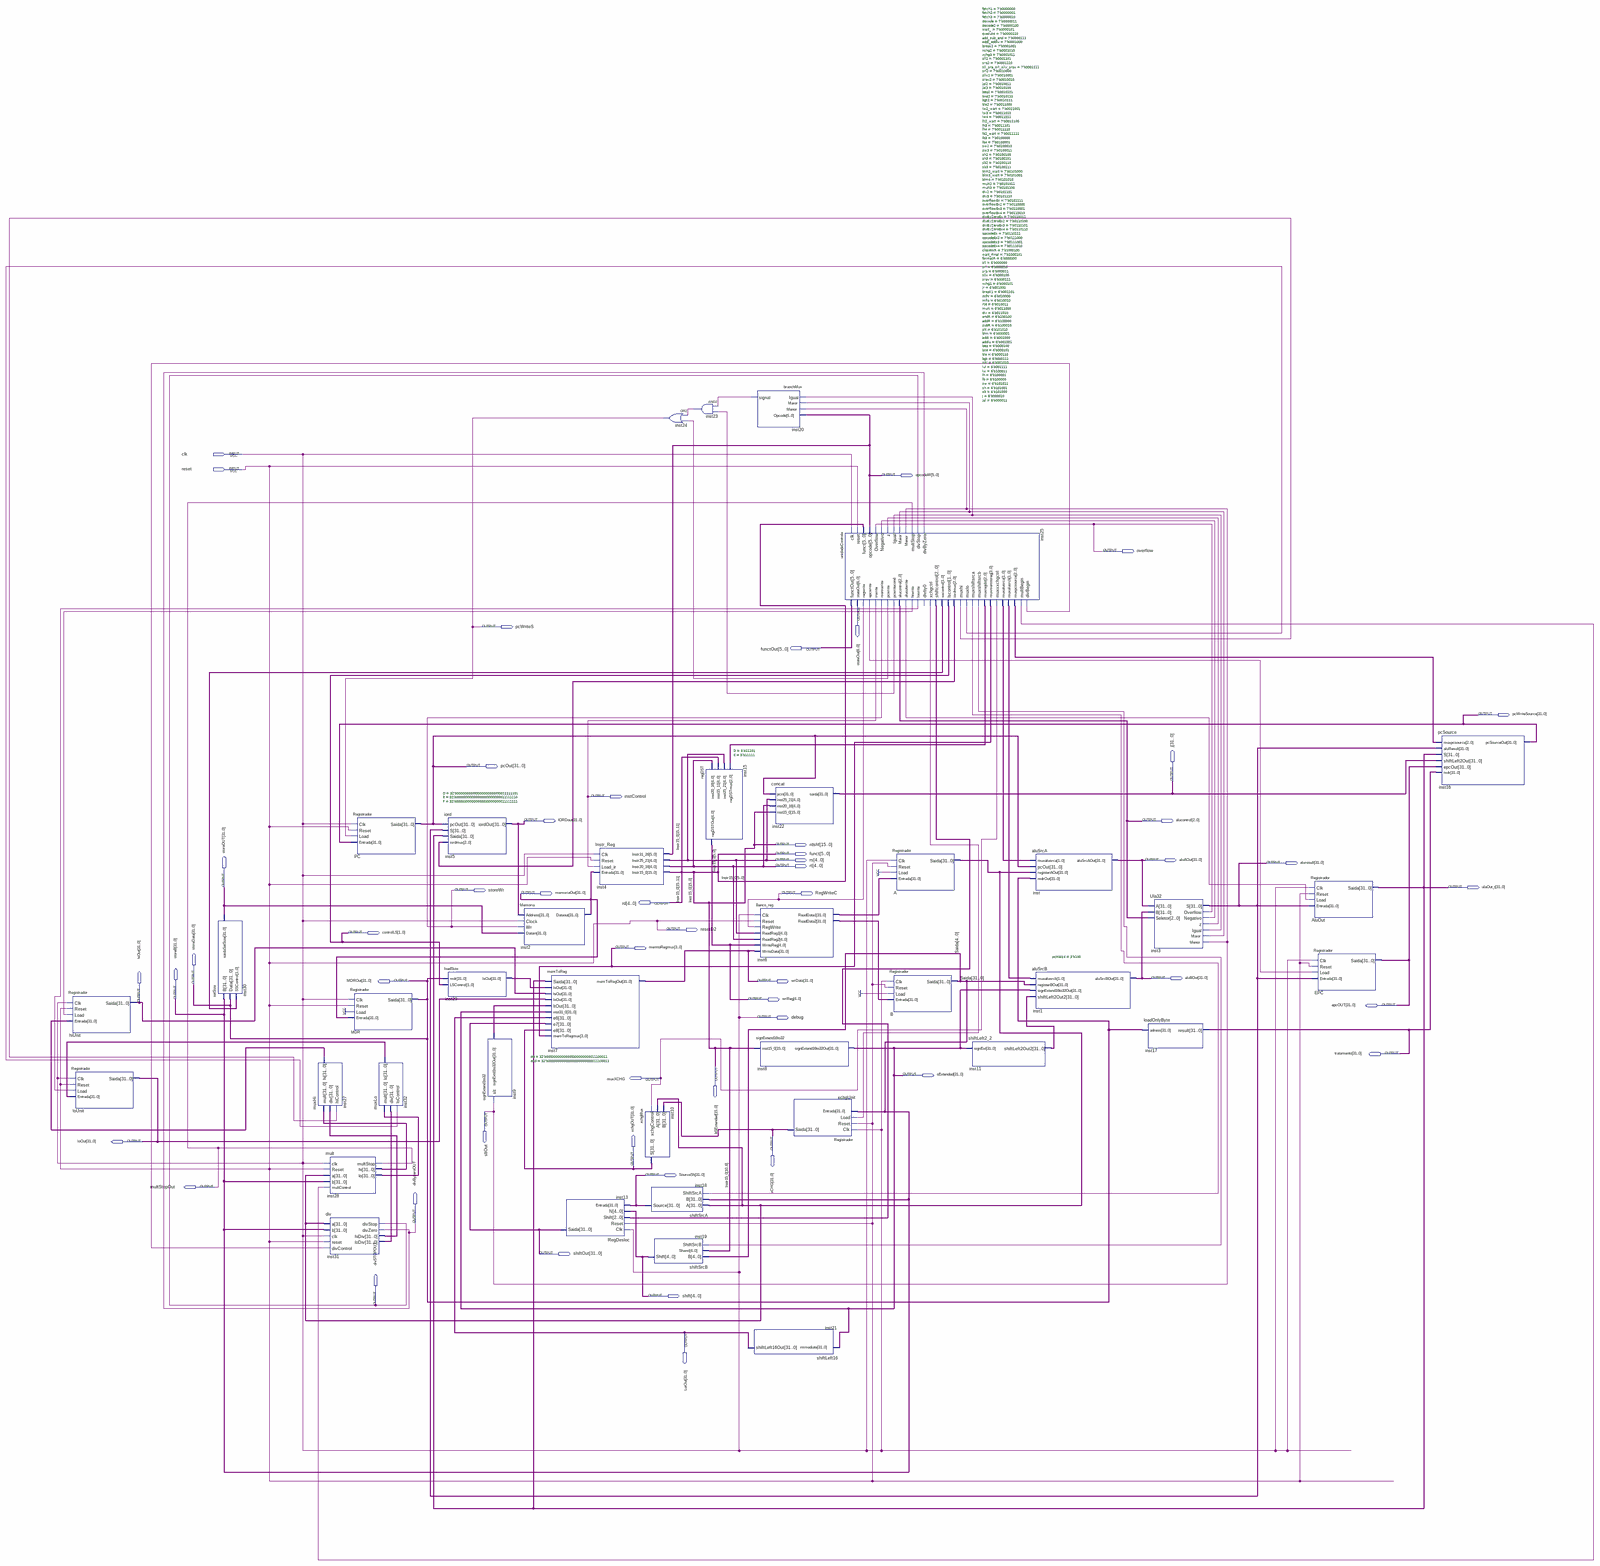
[diagram p0: schematic sheet, whole]
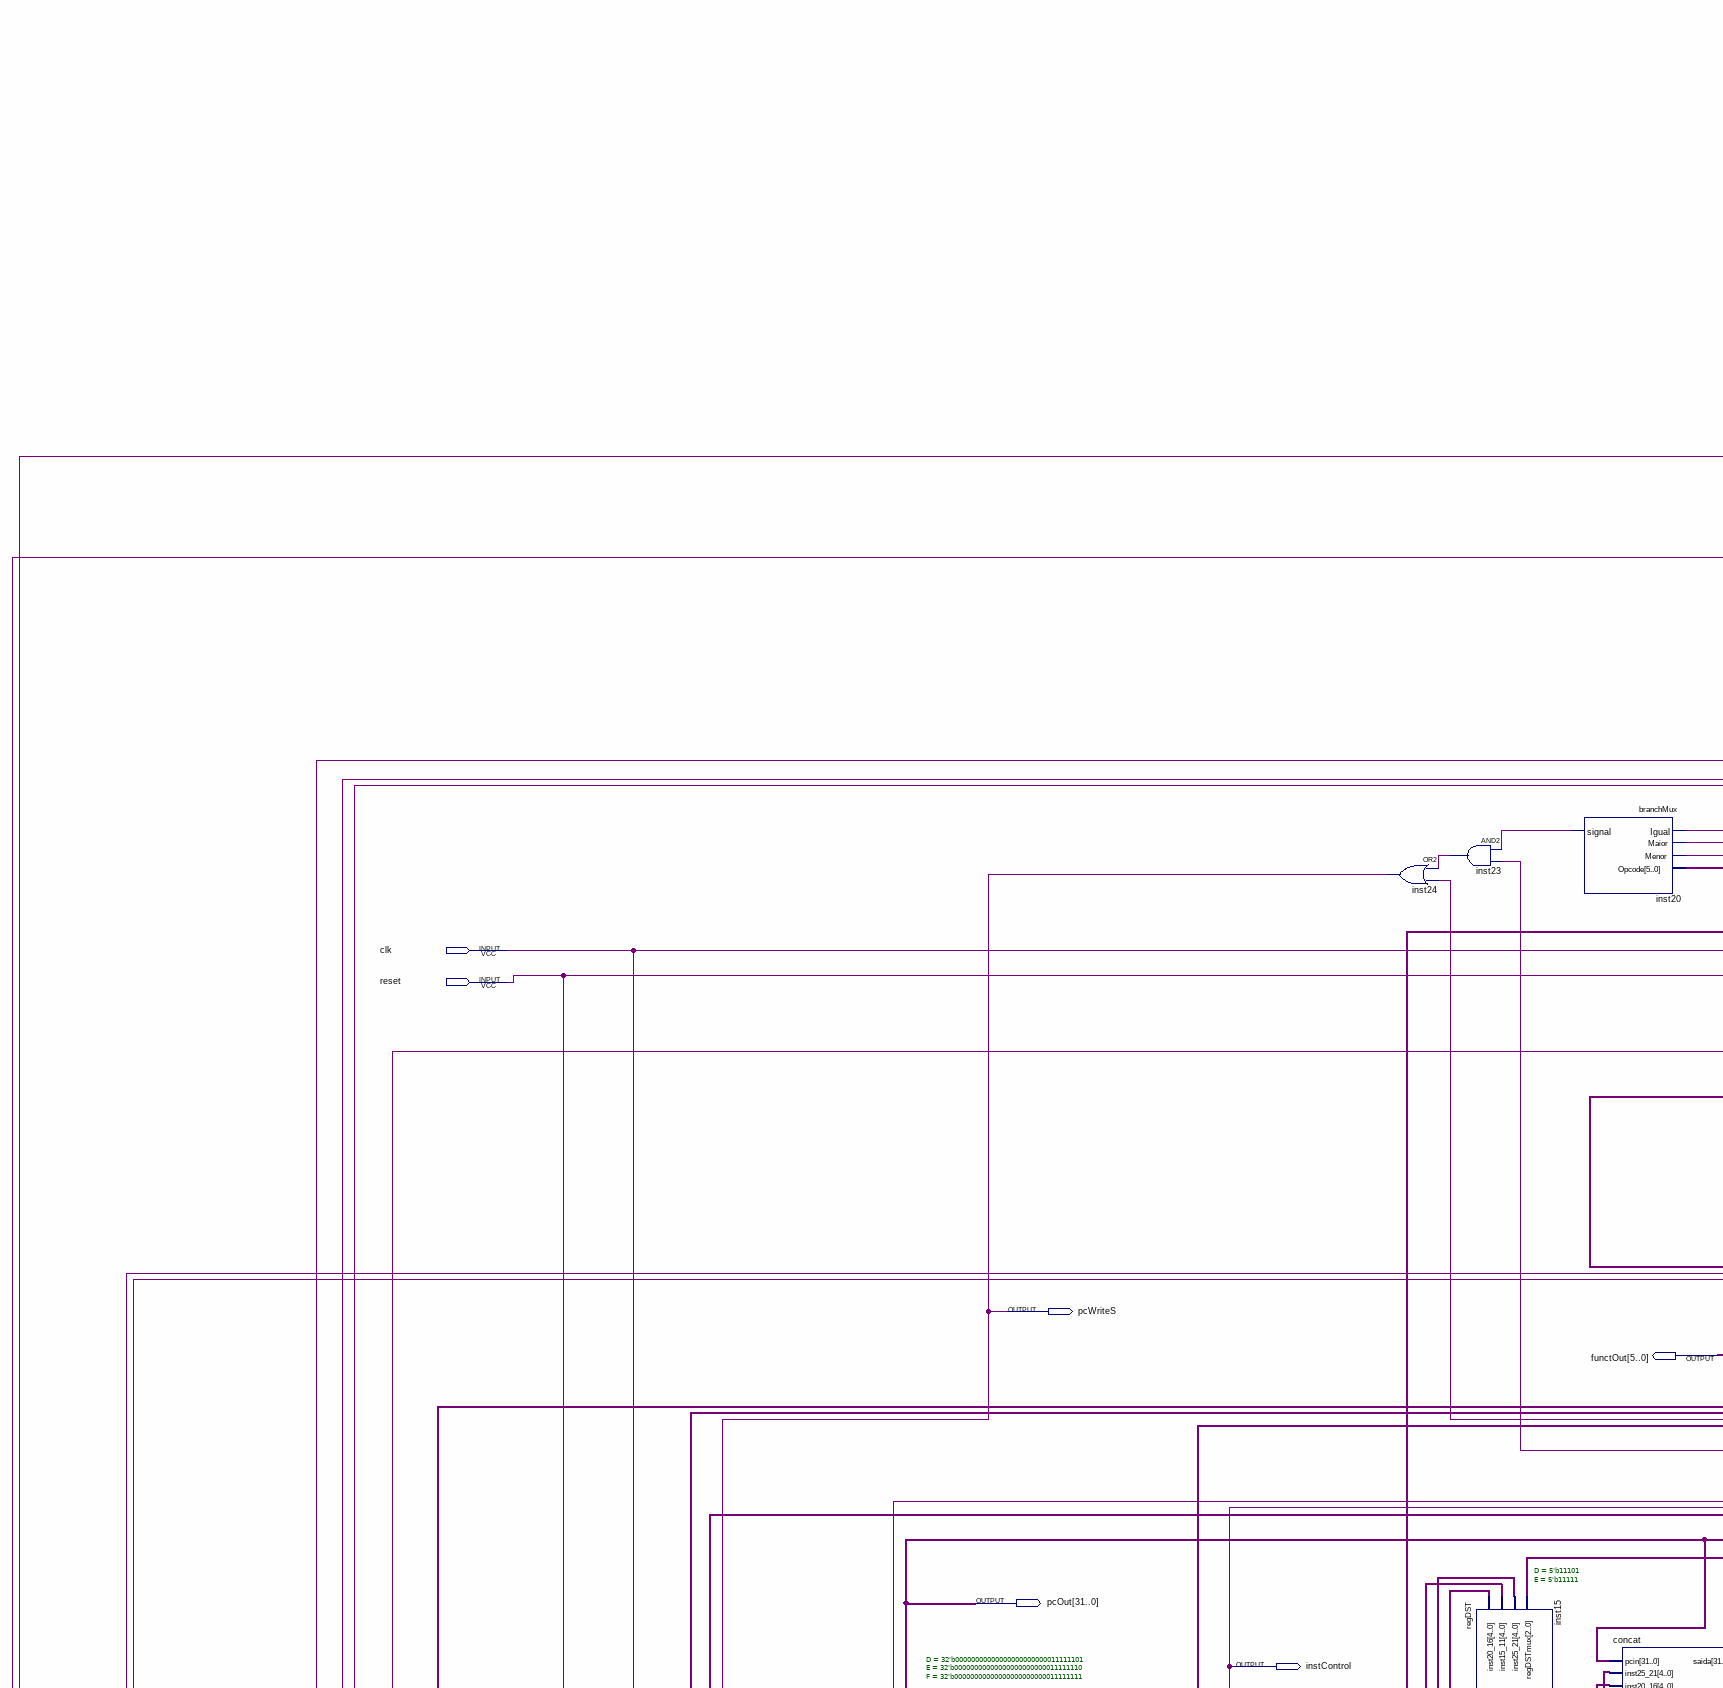
[diagram p1: schematic sheet, upper left part]
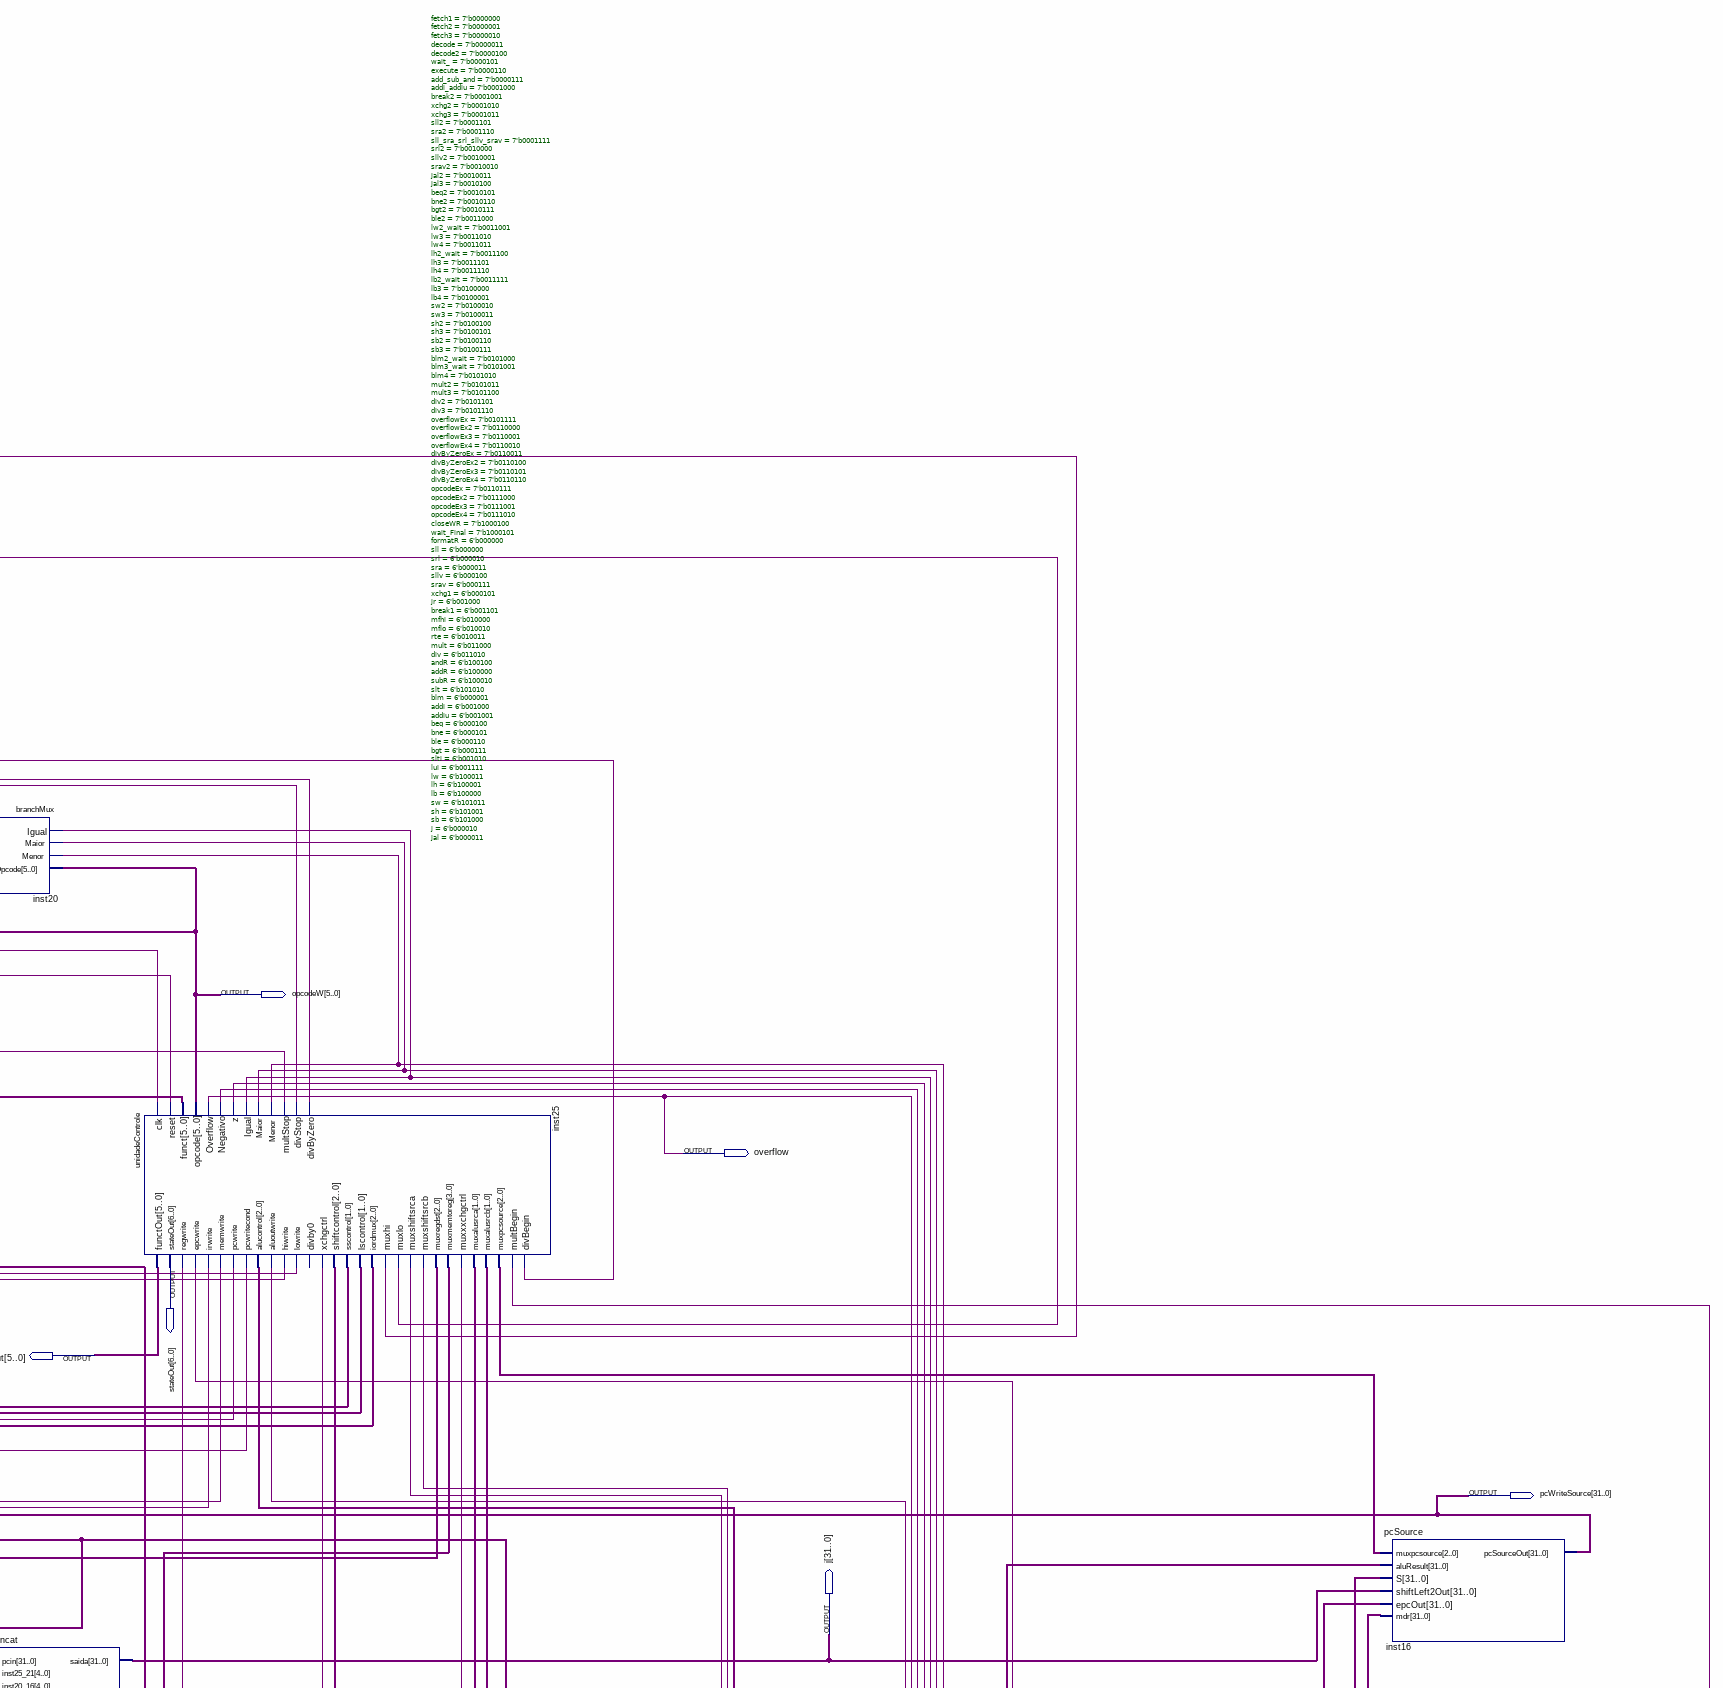
[diagram p2: schematic sheet, upper right part]
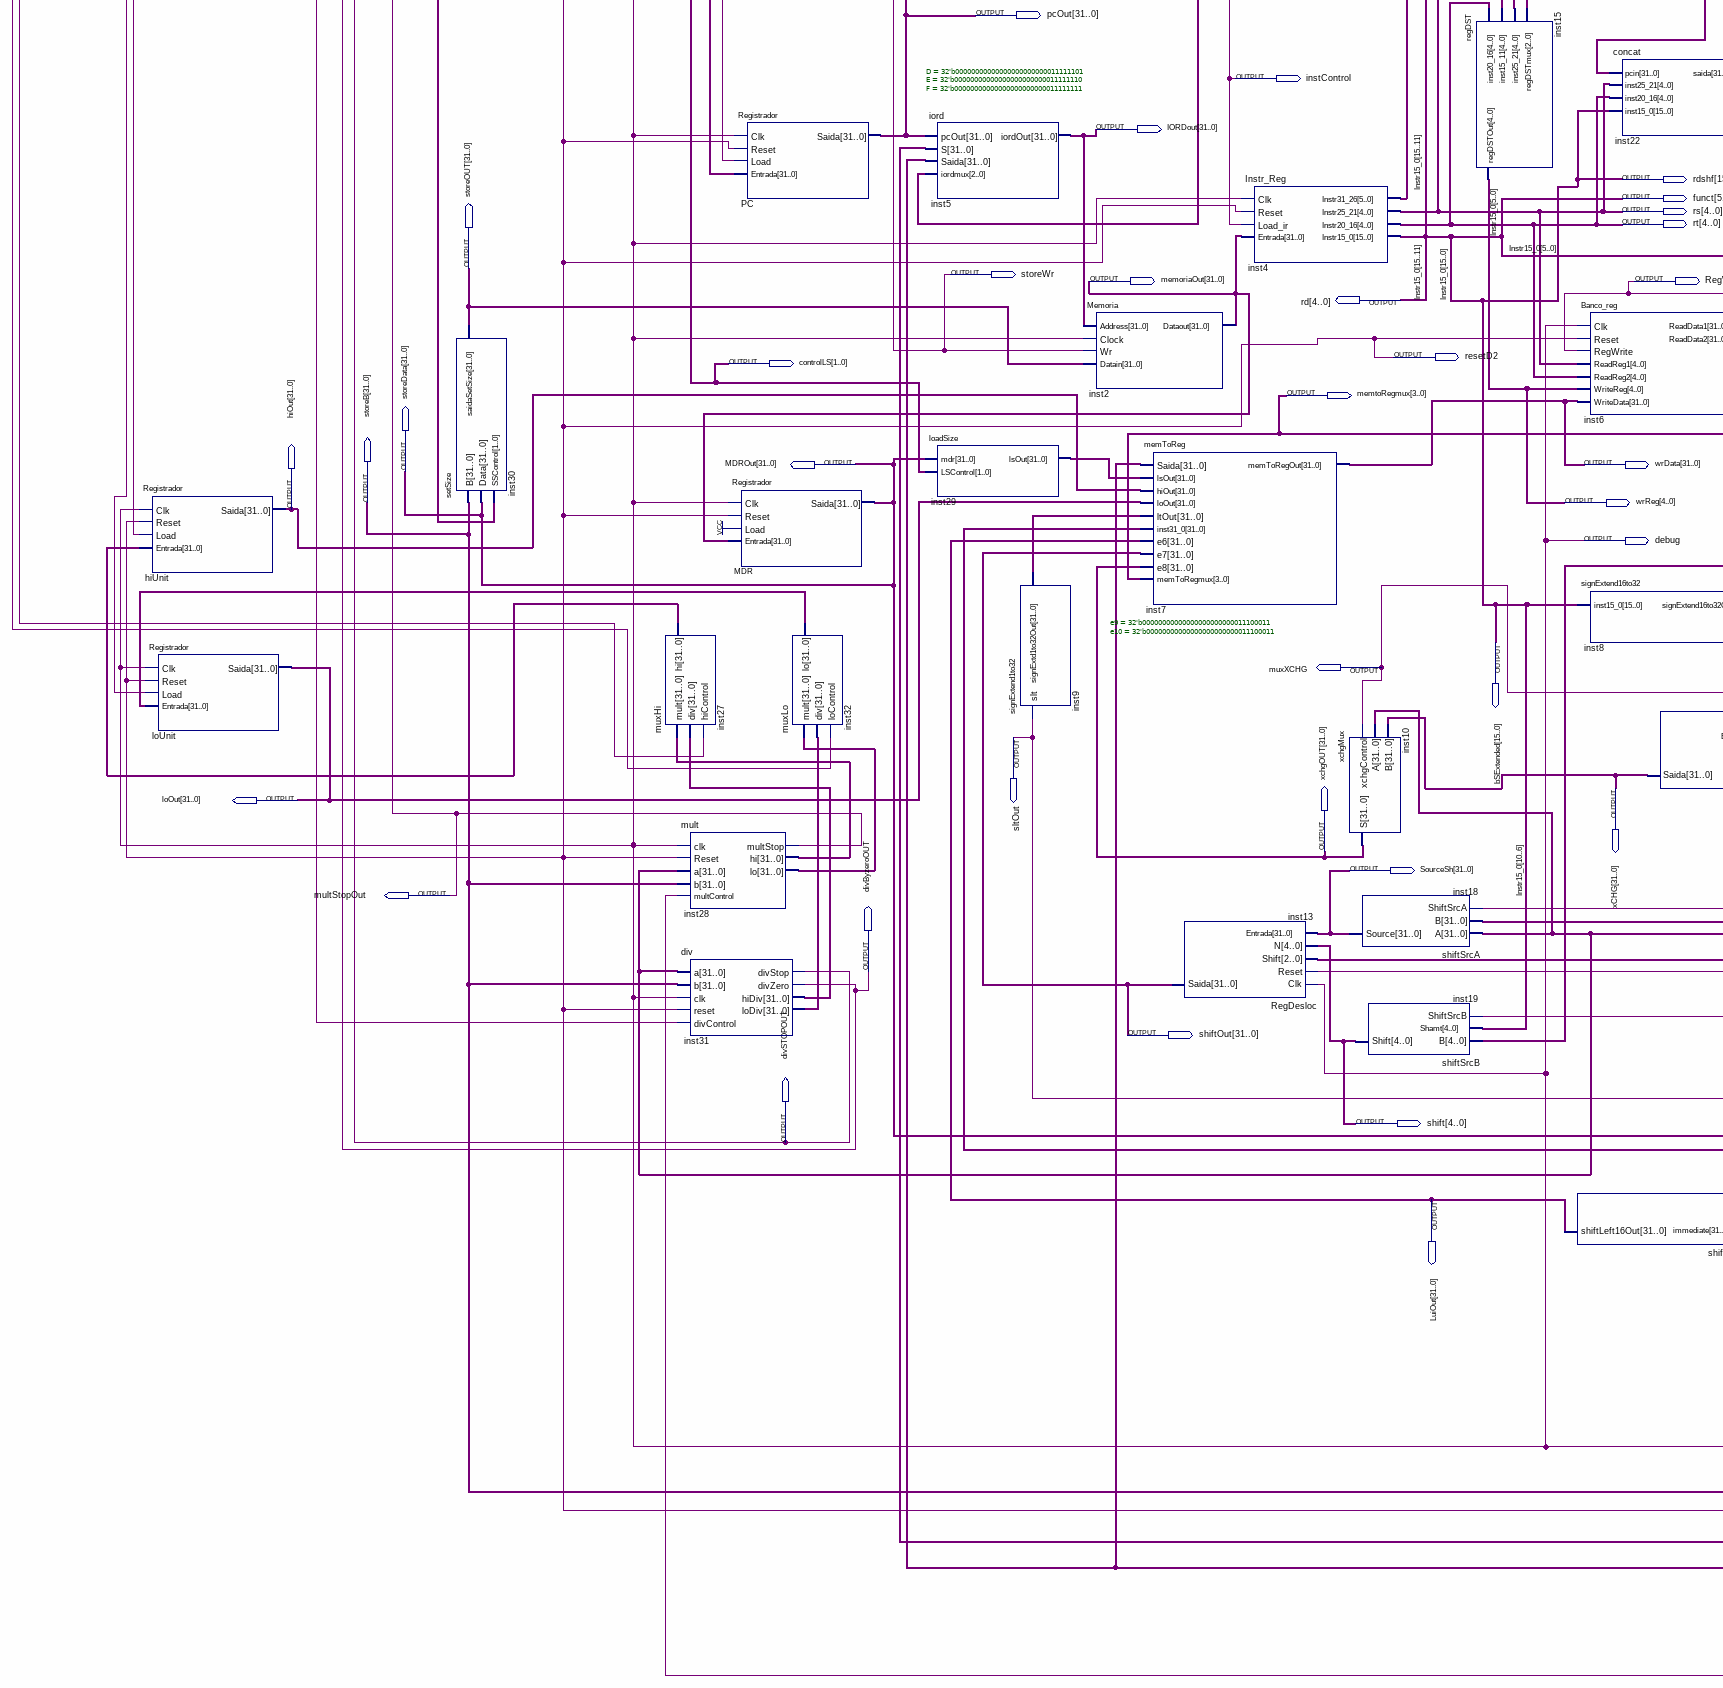
[diagram p3: schematic sheet, lower left part]
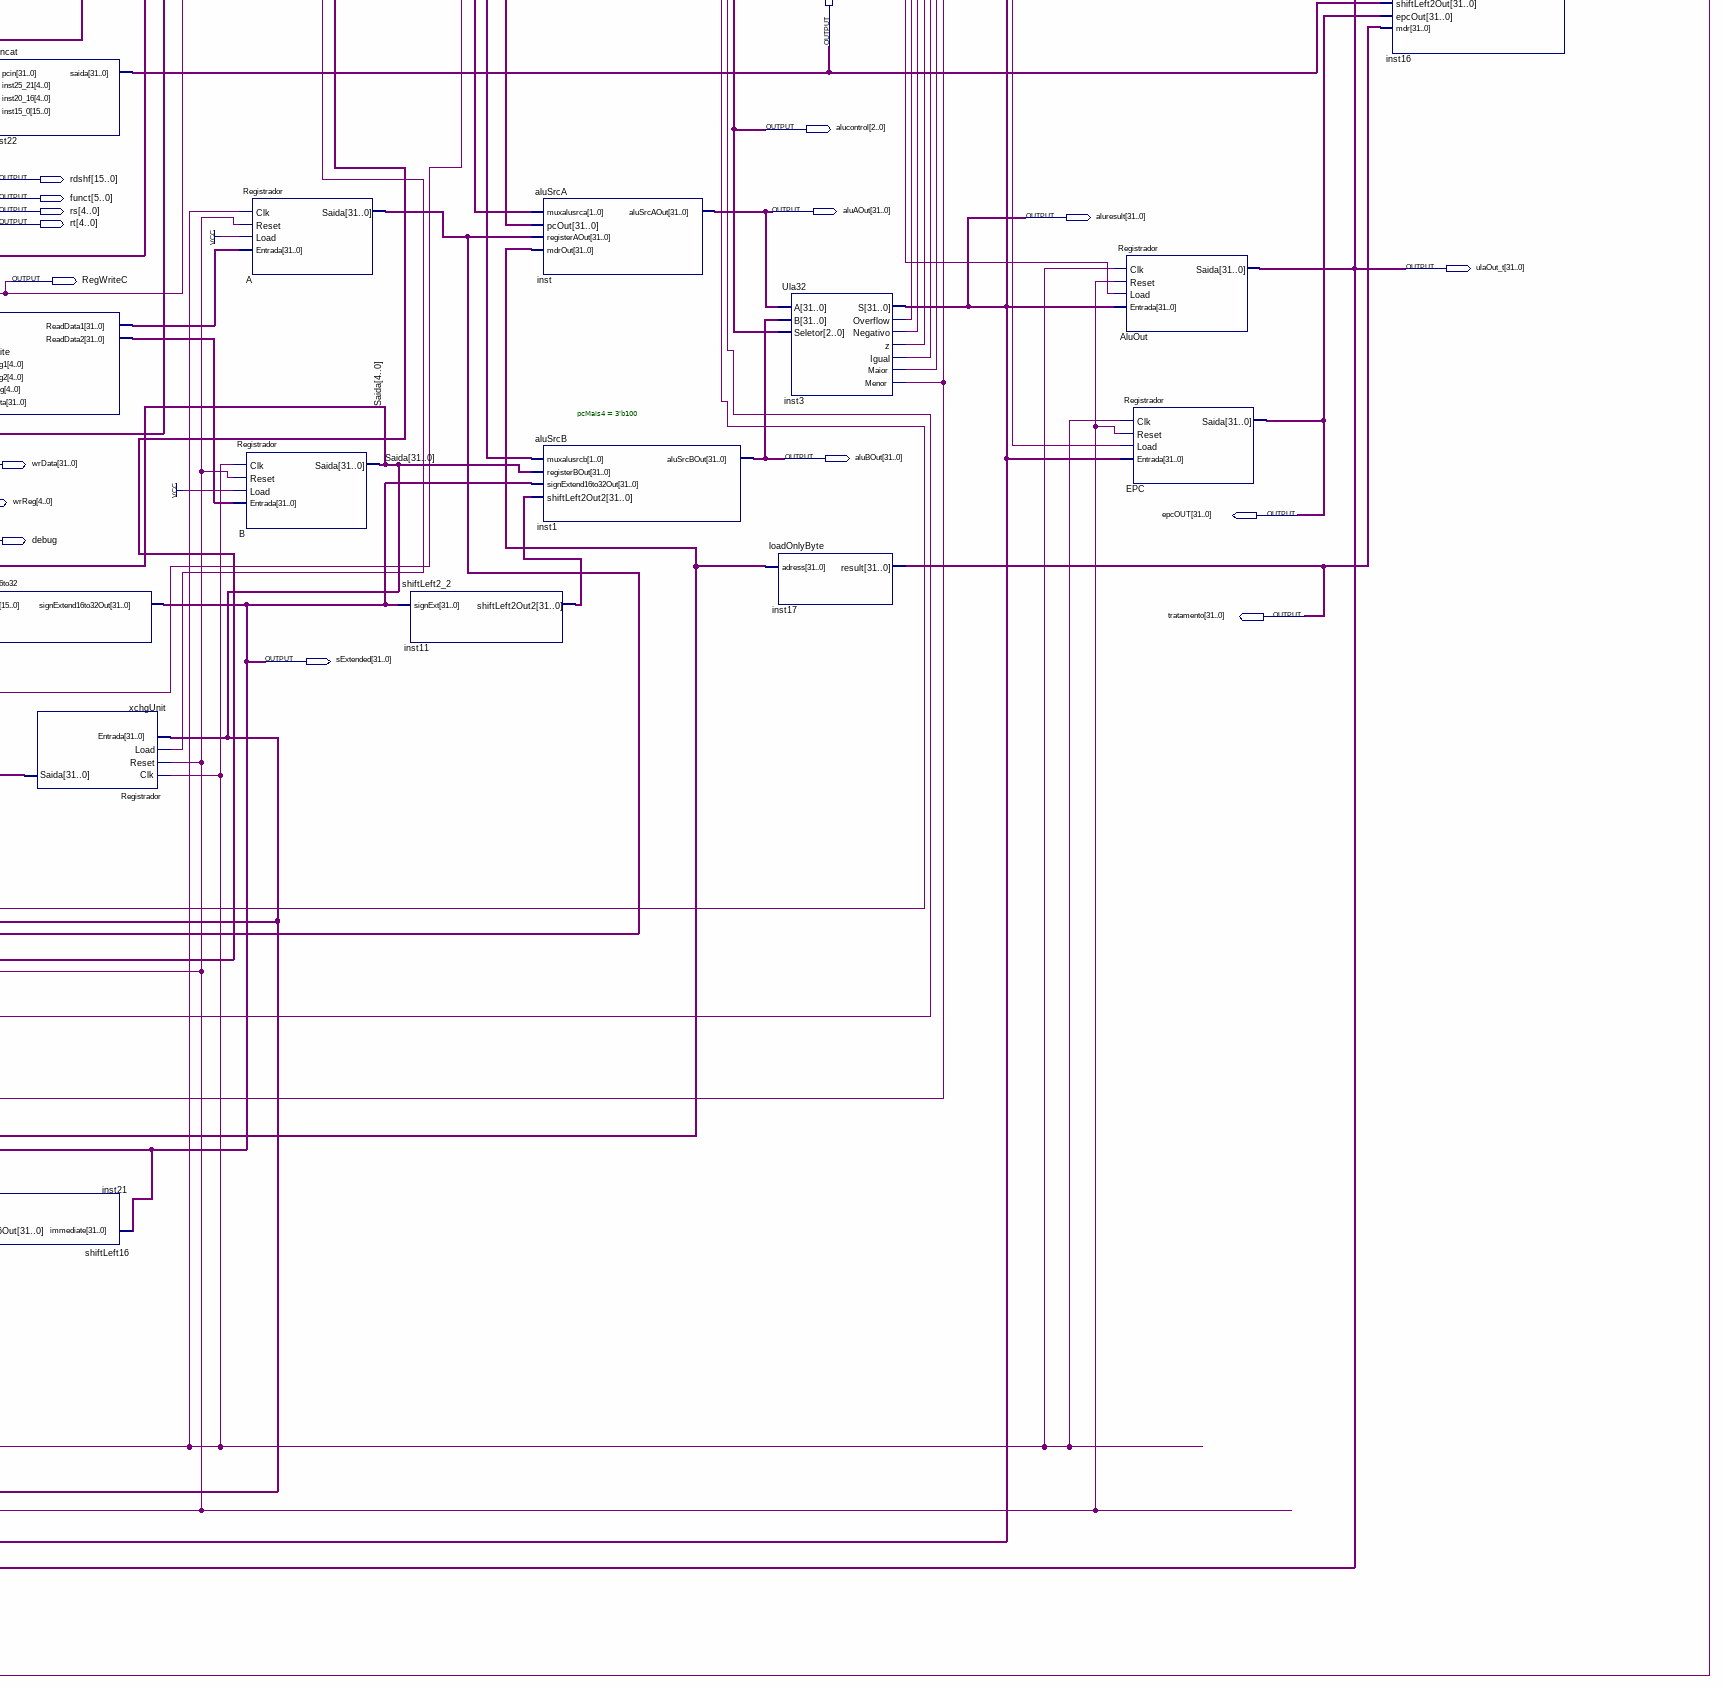
[diagram p4: schematic sheet, lower right part]
// Quartus schematic schemeHard.bdf as structural Verilog: 39 symbols, 52 pins
module schemeHard (
  input  clk,
  input  reset,
  output [5:0] opcodeW,
  output overflow,
  output [6:0] stateOut,
  output pcWriteS,
  output [5:0] functOut,
  output [31:0] pcWriteSource,
  output [31:0] pcOut,
  output [31:0] j,
  output instControl,
  output [31:0] IORDout,
  output [2:0] alucontrol,
  output [15:0] rdshf,
  output [5:0] funct,
  output [4:0] rs,
  output [31:0] aluAOut,
  output [31:0] aluresult,
  output [4:0] rt,
  output [31:0] storeOUT,
  output [31:0] ulaOut_t,
  output storeWr,
  output [31:0] memoriaOut,
  output RegWriteC,
  output [4:0] rd,
  output resetD2,
  output [1:0] controlLS,
  output [3:0] memtoRegmux,
  output [31:0] aluBOut,
  output [31:0] MDROut,
  output [31:0] wrData,
  output [31:0] storeData,
  output [31:0] storeB,
  output [4:0] wrReg,
  output [31:0] hiOut,
  output [31:0] epcOUT,
  output debug,
  output [31:0] tratamento,
  output [15:0] bSExtended,
  output [31:0] sExtended,
  output muxXCHG,
  output sltOut,
  output [31:0] xCHG,
  output [31:0] loOut,
  output [31:0] xchgOUT,
  output [31:0] SourceSh,
  output multStopOut,
  output divByzeroOUT,
  output [31:0] shiftOut,
  output [4:0] shift,
  output divSTOPOUT,
  output [31:0] LuiOut
);

  wire inst3_igual, inst3_maior, inst3_negativo, inst3_z, inst20_signal, inst23_out, inst25_aluoutwrite,
       inst25_divbegin, inst25_epcwrite, inst25_hiwrite, inst25_lowrite, inst25_multbegin, inst25_muxhi,
       inst25_muxlo, inst25_muxshiftsrca, inst25_muxshiftsrcb, inst25_pcwrite, inst25_pcwritecond,
       inst25_xchgctrl;
  wire [1:0] inst25_muxalusrca, inst25_muxalusrcb, inst25_sscontrol;
  wire [2:0] inst25_iordmux, inst25_muxpcsource, inst25_muxregdst, inst25_shiftcontrol;
  wire [31:0] A_saida, inst6_readdata1, inst6_readdata2, inst9_signextd1to32out, inst11_shiftleft2out2,
       inst27_hi, inst28_hi, inst28_lo, inst29_lsout, inst31_hidiv, inst31_lodiv, inst32_lo;

  Registrador hiUnit (.Clk(clk), .Reset(reset), .Load(inst25_hiwrite), .Entrada(inst27_hi), .Saida(hiOut));
  Registrador loUnit (.Clk(clk), .Reset(reset), .Load(inst25_lowrite), .Entrada(inst32_lo), .Saida(loOut));
  setSize inst30 (.B(storeB), .Data(MDROut), .SSControl(inst25_sscontrol), .saidaSetSize(storeOUT));
  muxHi inst27 (.mult(inst28_hi), .div(inst31_hidiv), .hiControl(inst25_muxhi), .hi(inst27_hi));
  mult inst28 (
    .clk(clk), .Reset(reset), .a(A_saida), .b(storeB), .multControl(inst25_multbegin),
    .multStop(multStopOut), .hi(inst28_hi), .lo(inst28_lo));
  div inst31 (
    .a(A_saida), .b(storeB), .clk(clk), .reset(reset), .divControl(inst25_divbegin), .divStop(divSTOPOUT),
    .divZero(divByzeroOUT), .hiDiv(inst31_hidiv), .loDiv(inst31_lodiv));
  Registrador PC (.Clk(clk), .Reset(reset), .Load(pcWriteS), .Entrada(pcWriteSource), .Saida(pcOut));
  Registrador MDR (.Clk(clk), .Reset(reset), .Load(1'b1), .Entrada(memoriaOut), .Saida(MDROut));
  muxLo inst32 (.mult(inst28_lo), .div(inst31_lodiv), .loControl(inst25_muxlo), .lo(inst32_lo));
  iord #(.D(32'b00000000000000000000000011111101), .E(32'b00000000000000000000000011111110), .F(32'b00000000000000000000000011111111)) inst5 (
    .pcOut(pcOut), .S(aluresult), .Saida(ulaOut_t), .iordmux(inst25_iordmux), .iordOut(IORDout));
  loadSize inst29 (.mdr(MDROut), .LSControl(controlLS), .lsOut(inst29_lsout));
  signExtend1to32 inst9 (.slt(sltOut), .signExtd1to32Out(inst9_signextd1to32out));
  Memoria inst2 (.Address(IORDout), .Clock(clk), .Wr(storeWr), .Datain(storeOUT), .Dataout(memoriaOut));
  memToReg #(.e9(32'b00000000000000000000000011100011), .e10(32'b00000000000000000000000011100011)) inst7 (
    .Saida(ulaOut_t), .lsOut(inst29_lsout), .hiOut(hiOut), .loOut(loOut), .ltOut(inst9_signextd1to32out),
    .inst31_0(sExtended), .e6(LuiOut), .e7(shiftOut), .e8(xchgOUT), .memToRegmux(memtoRegmux),
    .memToRegOut(wrData));
  RegDesloc inst13 (
    .Clk(clk), .Reset(reset), .Shift(inst25_shiftcontrol), .N(shift), .Entrada(SourceSh), .Saida(shiftOut));
  Instr_Reg inst4 (
    .Clk(clk), .Reset(reset), .Load_ir(instControl), .Entrada(memoriaOut), .Instr31_26(opcodeW),
    .Instr25_21(rs), .Instr20_16(rt), .Instr15_0(bSExtended));
  xchgMux inst10 (.xchgControl(muxXCHG), .A(A_saida), .B(xCHG), .S(xchgOUT));
  shiftSrcA inst18 (.A(A_saida), .B(storeB), .ShiftSrcA(inst25_muxshiftsrca), .Source(SourceSh));
  shiftSrcB inst19 (.B(storeB[4:0]), .Shamt(bSExtended[10:6]), .ShiftSrcB(inst25_muxshiftsrcb), .Shift(shift));
  or inst24 (pcWriteS, inst23_out, inst25_pcwrite);
  and inst23 (inst23_out, inst20_signal, inst25_pcwritecond);
  regDST #(.D(5'b11101), .E(5'b11111)) inst15 (
    .inst20_16(rt), .inst15_11(bSExtended[15:11]), .inst25_21(rs), .regDSTmux(inst25_muxregdst),
    .regDSTOut(wrReg));
  shiftLeft16 inst21 (.immediate(sExtended), .shiftLeft16Out(LuiOut));
  branchMux inst20 (.Igual(inst3_igual), .Maior(inst3_maior), .Menor(sltOut), .Opcode(opcodeW), .signal(inst20_signal));
  concat inst22 (.pcin(pcOut), .inst25_21(rs), .inst20_16(rt), .inst15_0(bSExtended), .saida(j));
  Banco_reg inst6 (
    .Clk(clk), .Reset(reset), .RegWrite(RegWriteC), .ReadReg1(rs), .ReadReg2(rt), .WriteReg(wrReg),
    .WriteData(wrData), .ReadData1(inst6_readdata1), .ReadData2(inst6_readdata2));
  signExtend16to32 inst8 (.inst15_0(bSExtended), .signExtend16to32Out(sExtended));
  Registrador xchgUnit (.Clk(clk), .Reset(reset), .Load(inst25_xchgctrl), .Entrada(storeB), .Saida(xCHG));
  unidadeControle #(.fetch1(7'b0000000), .fetch2(7'b0000001), .fetch3(7'b0000010), .decode(7'b0000011), .decode2(7'b0000100), .wait_(7'b0000101), .execute(7'b0000110), .add_sub_and(7'b0000111), .addi_addiu(7'b0001000), .break2(7'b0001001), .xchg2(7'b0001010), .xchg3(7'b0001011), .sll2(7'b0001101), .sra2(7'b0001110), .sll_sra_srl_sllv_srav(7'b0001111), .srl2(7'b0010000), .sllv2(7'b0010001), .srav2(7'b0010010), .jal2(7'b0010011), .jal3(7'b0010100), .beq2(7'b0010101), .bne2(7'b0010110), .bgt2(7'b0010111), .ble2(7'b0011000), .lw2_wait(7'b0011001), .lw3(7'b0011010), .lw4(7'b0011011), .lh2_wait(7'b0011100), .lh3(7'b0011101), .lh4(7'b0011110), .lb2_wait(7'b0011111), .lb3(7'b0100000), .lb4(7'b0100001), .sw2(7'b0100010), .sw3(7'b0100011), .sh2(7'b0100100), .sh3(7'b0100101), .sb2(7'b0100110), .sb3(7'b0100111), .blm2_wait(7'b0101000), .blm3_wait(7'b0101001), .blm4(7'b0101010), .mult2(7'b0101011), .mult3(7'b0101100), .div2(7'b0101101), .div3(7'b0101110), .overflowEx(7'b0101111), .overflowEx2(7'b0110000), .overflowEx3(7'b0110001), .overflowEx4(7'b0110010), .divByZeroEx(7'b0110011), .divByZeroEx2(7'b0110100), .divByZeroEx3(7'b0110101), .divByZeroEx4(7'b0110110), .opcodeEx(7'b0110111), .opcodeEx2(7'b0111000), .opcodeEx3(7'b0111001), .opcodeEx4(7'b0111010), .closeWR(7'b1000100), .wait_Final(7'b1000101), .formatR(6'b000000), .sll(6'b000000), .srl(6'b000010), .sra(6'b000011), .sllv(6'b000100), .srav(6'b000111), .xchg1(6'b000101), .jr(6'b001000), .break1(6'b001101), .mfhi(6'b010000), .mflo(6'b010010), .rte(6'b010011), .mult(6'b011000), .div(6'b011010), .andR(6'b100100), .addR(6'b100000), .subR(6'b100010), .slt(6'b101010), .blm(6'b000001), .addi(6'b001000), .addiu(6'b001001), .beq(6'b000100), .bne(6'b000101), .ble(6'b000110), .bgt(6'b000111), .slti(6'b001010), .lui(6'b001111), .lw(6'b100011), .lh(6'b100001), .lb(6'b100000), .sw(6'b101011), .sh(6'b101001), .sb(6'b101000), .j(6'b000010), .jal(6'b000011)) inst25 (
    .clk(clk), .reset(reset), .funct(bSExtended[5:0]), .opcode(opcodeW), .Overflow(overflow),
    .Negativo(inst3_negativo), .z(inst3_z), .Igual(inst3_igual), .Maior(inst3_maior), .Menor(sltOut),
    .multStop(multStopOut), .divStop(divSTOPOUT), .divByZero(divByzeroOUT), .functOut(functOut),
    .stateOut(stateOut), .regwrite(RegWriteC), .epcwrite(inst25_epcwrite), .irwrite(instControl),
    .memwrite(storeWr), .pcwrite(inst25_pcwrite), .pcwritecond(inst25_pcwritecond), .alucontrol(alucontrol),
    .aluoutwrite(inst25_aluoutwrite), .hiwrite(inst25_hiwrite), .lowrite(inst25_lowrite),
    .xchgctrl(inst25_xchgctrl), .shiftcontrol(inst25_shiftcontrol), .sscontrol(inst25_sscontrol),
    .lscontrol(controlLS), .iordmux(inst25_iordmux), .muxhi(inst25_muxhi), .muxlo(inst25_muxlo),
    .muxshiftsrca(inst25_muxshiftsrca), .muxshiftsrcb(inst25_muxshiftsrcb), .muxregdst(inst25_muxregdst),
    .muxmemtoreg(memtoRegmux), .muxxxchgctrl(muxXCHG), .muxalusrca(inst25_muxalusrca),
    .muxalusrcb(inst25_muxalusrcb), .muxpcsource(inst25_muxpcsource), .multBegin(inst25_multbegin),
    .divBegin(inst25_divbegin));  // open: divby0
  Registrador A (.Clk(clk), .Reset(reset), .Load(1'b1), .Entrada(inst6_readdata1), .Saida(A_saida));
  Registrador B (.Clk(clk), .Reset(reset), .Load(1'b1), .Entrada(inst6_readdata2), .Saida(storeB));
  shiftLeft2_2 inst11 (.signExt(sExtended), .shiftLeft2Out2(inst11_shiftleft2out2));
  aluSrcA inst (
    .muxalusrca(inst25_muxalusrca), .pcOut(pcOut), .registerAOut(A_saida), .mdrOut(MDROut),
    .aluSrcAOut(aluAOut));
  aluSrcB #(.pcMais4(3'b100)) inst1 (
    .muxalusrcb(inst25_muxalusrcb), .registerBOut(storeB), .signExtend16to32Out(sExtended),
    .shiftLeft2Out2(inst11_shiftleft2out2), .aluSrcBOut(aluBOut));
  Ula32 inst3 (
    .A(aluAOut), .B(aluBOut), .Seletor(alucontrol), .S(aluresult), .Overflow(overflow),
    .Negativo(inst3_negativo), .z(inst3_z), .Igual(inst3_igual), .Maior(inst3_maior), .Menor(sltOut));
  loadOnlyByte inst17 (.adress(MDROut), .result(tratamento));
  Registrador AluOut (.Clk(clk), .Reset(reset), .Load(inst25_aluoutwrite), .Entrada(aluresult), .Saida(ulaOut_t));
  Registrador EPC (.Clk(clk), .Reset(reset), .Load(inst25_epcwrite), .Entrada(aluresult), .Saida(epcOUT));
  pcSource inst16 (
    .muxpcsource(inst25_muxpcsource), .aluResult(aluresult), .S(ulaOut_t), .shiftLeft2Out(j),
    .epcOut(epcOUT), .mdr(tratamento), .pcSourceOut(pcWriteSource));

  assign debug = clk;
  assign funct = bSExtended[5:0];
  assign rd = bSExtended[15:11];
  assign rdshf = bSExtended;
  assign resetD2 = reset;
  assign storeData = MDROut;

  // Other names for the same wires on the sheet: Instr15_0[15:0] = bSExtended; Saida[31:0] = storeB
endmodule
